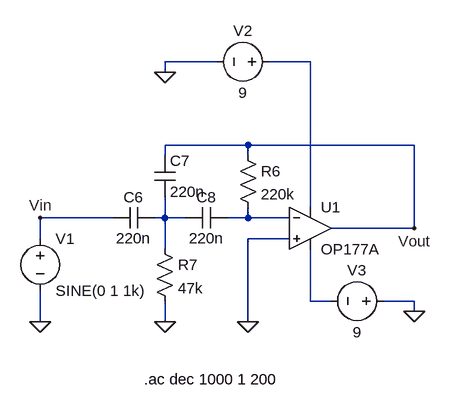
[diagram p0: schematic 7Hz-High-Pass.asc]
7Hz-High-Pass.asc, the LTspice schematic file:
Version 4
SHEET 1 880 680
WIRE 240 48 160 48
WIRE 384 48 320 48
WIRE 160 64 160 48
WIRE 288 176 160 176
WIRE 544 176 288 176
WIRE 160 192 160 176
WIRE 288 192 288 176
WIRE 384 272 384 48
WIRE 80 288 -32 288
WIRE 160 288 160 256
WIRE 160 288 144 288
WIRE 192 288 160 288
WIRE 288 288 288 272
WIRE 288 288 256 288
WIRE 352 288 288 288
WIRE 544 304 544 176
WIRE 544 304 416 304
WIRE -32 320 -32 288
WIRE 352 320 288 320
WIRE 160 336 160 288
WIRE 384 416 384 336
WIRE 416 416 384 416
WIRE 544 416 496 416
WIRE 544 432 544 416
WIRE -32 448 -32 400
WIRE 160 448 160 416
WIRE 288 448 288 320
FLAG 160 448 0
FLAG 288 448 0
FLAG 544 432 0
FLAG 160 64 0
FLAG -32 288 Vin
FLAG 544 304 Vout
FLAG -32 448 0
SYMBOL OpAmps/OP177A 384 240 R0
SYMATTR InstName U1
SYMBOL Res 272 176 R0
SYMATTR InstName R6
SYMATTR Value 220k
SYMBOL Res 144 320 R0
SYMATTR InstName R7
SYMATTR Value 47k
SYMBOL Cap 144 192 R0
SYMATTR InstName C7
SYMATTR Value 220n
SYMBOL Cap 144 272 R90
WINDOW 0 0 32 VBottom 2
WINDOW 3 32 32 VTop 2
SYMATTR InstName C6
SYMATTR Value 220n
SYMBOL Voltage -32 304 R0
SYMATTR InstName V1
SYMATTR Value SINE(0 1 1k)
SYMATTR Value2 AC 1
SYMBOL Cap 256 272 R90
WINDOW 0 0 32 VBottom 2
WINDOW 3 32 32 VTop 2
SYMATTR InstName C8
SYMATTR Value 220n
SYMBOL Voltage 336 48 R90
WINDOW 0 -32 56 VBottom 2
WINDOW 3 32 56 VTop 2
SYMATTR InstName V2
SYMATTR Value 9
SYMBOL Voltage 512 416 R90
WINDOW 0 -32 56 VBottom 2
WINDOW 3 32 56 VTop 2
SYMATTR InstName V3
SYMATTR Value 9
TEXT 128 536 Left 2 !.ac dec 1000 1 200

The netlist it stands for:
* 7Hz-High-Pass.asc
XU1 0 N003 N001 N004 Vout OP177A  ; pins In+ In- V+ V- OUT
R6 Vout N003 220k
R7 N002 0 47k
C7 Vout N002 220n
C6 N002 Vin 220n
V1 Vin 0 SINE(0 1 1k) AC 1
C8 N003 N002 220n
V2 N001 0 9
V3 0 N004 9
.ac dec 1000 1 200
.backanno
.end